# Altium schematic sheet Power_Path.SchDoc
size 297 x 209 mm; SheetNumber: 2; SheetTotal: 9
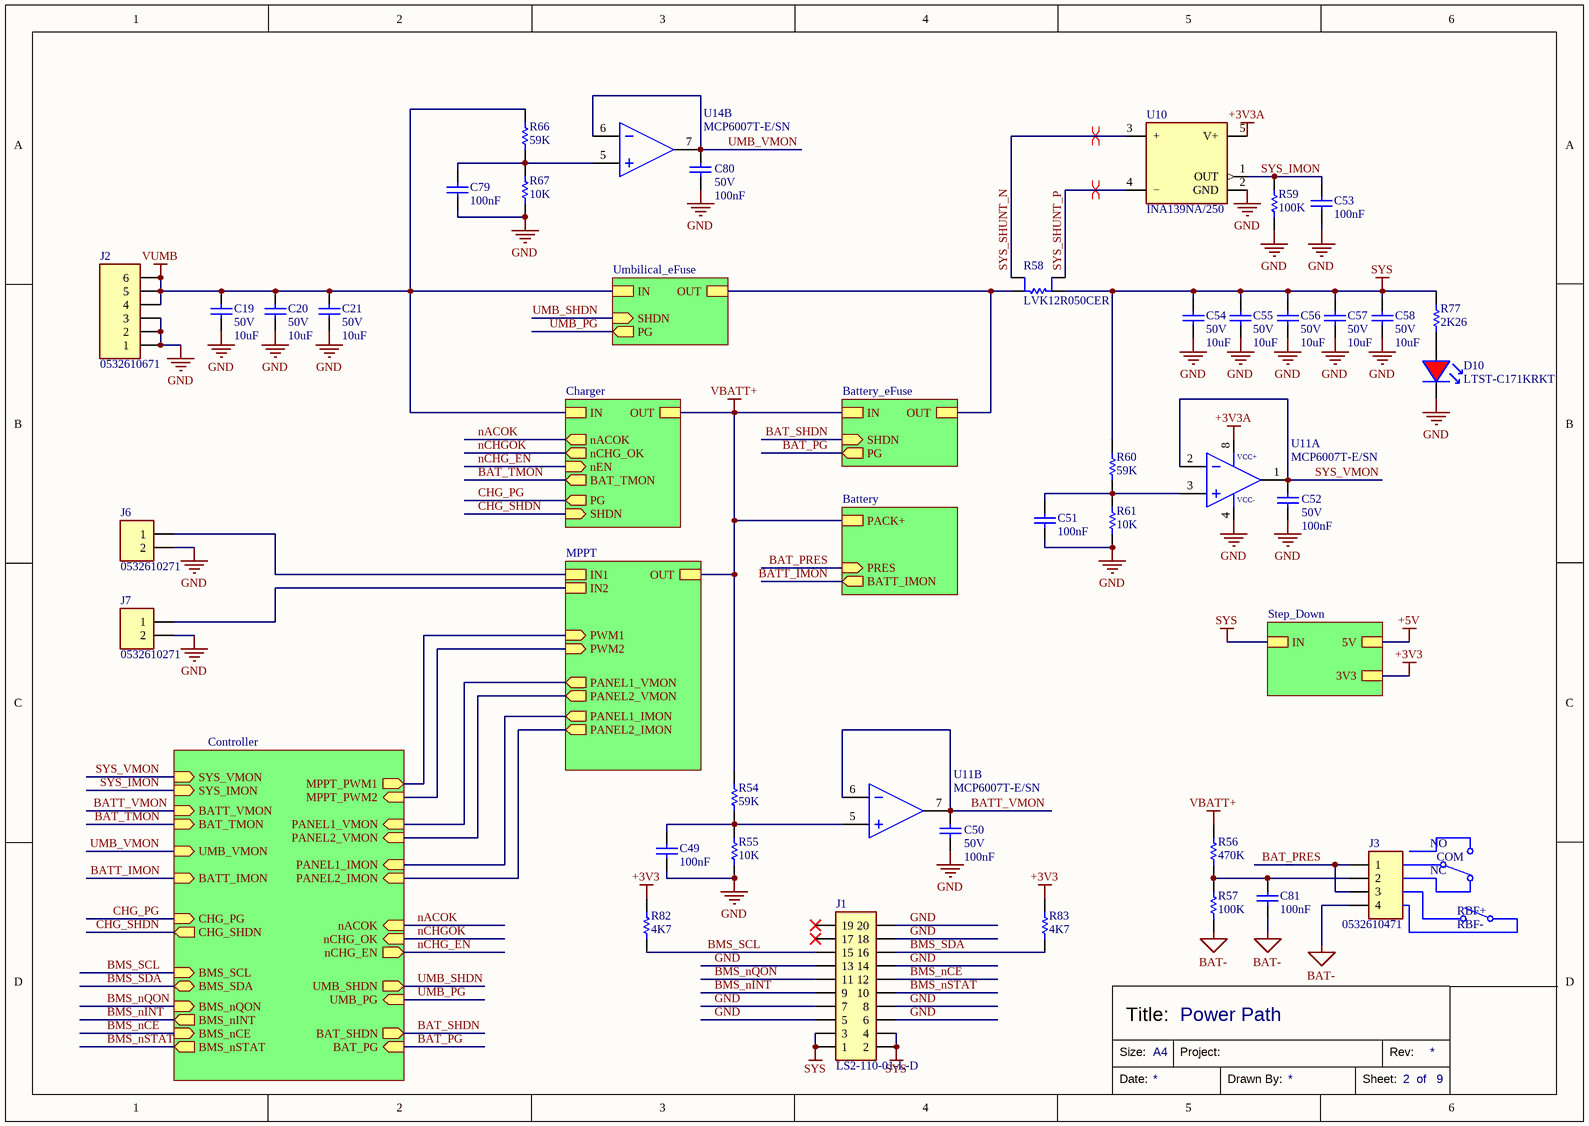
[diagram p0: Power_Path.SchDoc]

## Parts
C19  Voltage Rating: 50V  Capacitance: 10uF  [CAPC1210X090]  (hidden comment: CL32B106KBJNNNE)
C20  Voltage Rating: 50V  Capacitance: 10uF  [CAPC1210X090]  (hidden comment: CL32B106KBJNNNE)
C21  Voltage Rating: 50V  Capacitance: 10uF  [CAPC1210X090]  (hidden comment: CL32B106KBJNNNE)
C49  Capacitance: 100nF  [CAPC0603X040]  (hidden comment: C0603C104K5RACTU)
C50  Voltage Rating: 50V  Capacitance: 100nF  [CAPC0603X040]  (hidden comment: C0603C104K5RACTU)
C51  Capacitance: 100nF  [CAPC0603X040]  (hidden comment: C0603C104K5RACTU)
C52  Voltage Rating: 50V  Capacitance: 100nF  [CAPC0603X040]  (hidden comment: C0603C104K5RACTU)
C53  Capacitance: 100nF  [CAPC0603X040]  (hidden comment: C0603C104K5RACTU)
C54  Voltage Rating: 50V  Capacitance: 10uF  [CAPC1210X090]  (hidden comment: CL32B106KBJNNNE)
C55  Voltage Rating: 50V  Capacitance: 10uF  [CAPC1210X090]  (hidden comment: CL32B106KBJNNNE)
C56  Voltage Rating: 50V  Capacitance: 10uF  [CAPC1210X090]  (hidden comment: CL32B106KBJNNNE)
C57  Voltage Rating: 50V  Capacitance: 10uF  [CAPC1210X090]  (hidden comment: CL32B106KBJNNNE)
C58  Voltage Rating: 50V  Capacitance: 10uF  [CAPC1210X090]  (hidden comment: CL32B106KBJNNNE)
C79  Capacitance: 100nF  [CAPC0603X040]  (hidden comment: C0603C104K5RACTU)
C80  Voltage Rating: 50V  Capacitance: 100nF  [CAPC0603X040]  (hidden comment: C0603C104K5RACTU)
C81  Capacitance: 100nF  [CAPC0603X040]  (hidden comment: C0603C104K5RACTU)
D10  LTST-C171KRKT  [LEDR_0805]
J1  LS2-110-01-L-D  [LS2-110-01-L-D]
J2  0532610671  [0532610671]
J3  0532610471  [0532610471]
J6  0532610271  [0532610271]
J7  0532610271  [0532610271]
R54  Resistance: 59K  [RESC0603]  (hidden comment: RMCF0603FT59K0)
R55  Resistance: 10K  [RESC0603]  (hidden comment: RMCF0603FT10K0)
R56  Resistance: 470K  [RESC0603]  (hidden comment: RMCF0603FT470K)
R57  Resistance: 100K  [RESC0603]  (hidden comment: RMCF0603FT100K)
R58  LVK12R050CER  [LVK12R050CER-1]
R59  Resistance: 100K  [RESC0603]  (hidden comment: RMCF0603FT100K)
R60  Resistance: 59K  [RESC0603]  (hidden comment: RMCF0603FT59K0)
R61  Resistance: 10K  [RESC0603]  (hidden comment: RMCF0603FT10K0)
R66  Resistance: 59K  [RESC0603]  (hidden comment: RMCF0603FT59K0)
R67  Resistance: 10K  [RESC0603]  (hidden comment: RMCF0603FT10K0)
R77  Resistance: 2K26  [RESC0603]  (hidden comment: RMCF0603FT2K26)
R82  Resistance: 4K7  [RESC0603]  (hidden comment: RMCF0603FT4K7)
R83  Resistance: 4K7  [RESC0603]  (hidden comment: RMCF0603FT4K7)
U10  INA139NA/250  [SOT23-5 IC]
U11  MCP6007T-E/SN  [SOIC-8]  (parts A,B of 2)
U14  MCP6007T-E/SN  [SOIC-8]  (part B of 2)

## Sub-sheets
Battery = Battery_Protection: PACK+, PRES (in), BATT_IMON (out)
Battery_eFuse = Battery_eFuse: IN, OUT, SHDN (in), PG (out)
Charger = Charger: IN, OUT, nACOK (out), nCHG_OK (out), nEN (in), BAT_TMON (out), PG (out), SHDN (in)
Controller = Controller: MPPT_PWM1 (out), MPPT_PWM2 (in), PANEL1_VMON (in), PANEL2_VMON (in), PANEL1_IMON (in), PANEL2_IMON (in), nACOK (in), nCHG_OK (in), nCHG_EN (out), UMB_SHDN (out), UMB_PG (in), BAT_SHDN (out), BAT_PG (in), SYS_VMON (in), SYS_IMON (in), BAT_TMON (in), UMB_VMON (in), BATT_IMON (in), CHG_PG (in), CHG_SHDN (out), BATT_VMON (in), BMS_SCL (in), BMS_SDA (bidir), BMS_nINT (out), BMS_nCE (in), BMS_nSTAT (out), BMS_nQON (in)
MPPT = MPPT: IN1, OUT, PWM1 (in), IN2, PWM2 (in), PANEL1_VMON (out), PANEL2_VMON (out), PANEL1_IMON (out), PANEL2_IMON (out)
Step_Down = Step_Down: IN, 5V, 3V3
Umbilical_eFuse = Umbilical_eFuse: IN, OUT, SHDN (in), PG (out)

## Nets
+3V3: R82.2 R83.2 ; sheet Step_Down/3V3
+3V3A: U10.5(V+) U11.8(VCC+)
+5V: sheet Step_Down/5V
BAT-: C81.1 J3.4 R57.1
GND: C19.1 C20.1 C21.1 C49.1 C50.1 C51.1 C52.1 C53.1 C54.1 C55.1 C56.1 C57.1 C58.1 C79.1 C80.1 D10.K J1.5 J1.6 J1.7 J1.8 J1.13 J1.14 J1.18 J1.20 J2.1 J2.2 J2.3 J6.2 J7.2 R55.1 R59.1 R61.1 R67.1 U10.2(GND) U11.4(VCC-)
SYS: C54.2 C55.2 C56.2 C57.2 C58.2 J1.1 J1.2 J1.3 J1.4 R58.4 R60.2 R77.2 ; sheet Step_Down/IN
VBATT+: R54.2 R56.2 ; sheet Battery/PACK+, sheet Battery_eFuse/IN, sheet Charger/OUT, sheet MPPT/OUT
VUMB: C19.2 C20.2 C21.2 J2.4 J2.5 J2.6 R66.2 ; sheet Umbilical_eFuse/IN, sheet Charger/IN
BAT_PG: sheet Battery_eFuse/PG, sheet Controller/BAT_PG
BAT_PRES: J3.1 J3.3 ; sheet Battery/PRES
BAT_SHDN: sheet Battery_eFuse/SHDN, sheet Controller/BAT_SHDN
BAT_TMON: sheet Charger/BAT_TMON, sheet Controller/BAT_TMON
BATT_IMON: sheet Battery/BATT_IMON, sheet Controller/BATT_IMON
BATT_VMON: C50.2 U11.6(INB-) U11.7(OUTB) ; sheet Controller/BATT_VMON
BMS_nCE: J1.12 ; sheet Controller/BMS_nCE
BMS_nINT: J1.9 ; sheet Controller/BMS_nINT
BMS_nQON: J1.11 ; sheet Controller/BMS_nQON
BMS_nSTAT: J1.10 ; sheet Controller/BMS_nSTAT
BMS_SCL: J1.15 R82.1 ; sheet Controller/BMS_SCL
BMS_SDA: J1.16 R83.1 ; sheet Controller/BMS_SDA
CHG_PG: sheet Charger/PG, sheet Controller/CHG_PG
CHG_SHDN: sheet Charger/SHDN, sheet Controller/CHG_SHDN
nACOK: sheet Charger/nACOK, sheet Controller/nACOK
nCHG_EN: sheet Charger/nEN, sheet Controller/nCHG_EN
nCHGOK: sheet Charger/nCHG_OK, sheet Controller/nCHG_OK
SYS_IMON: C53.2 R59.2 U10.1(OUT) ; sheet Controller/SYS_IMON
SYS_SHUNT_N: R58.2 U10.3(+)
SYS_SHUNT_P: R58.3 U10.4(−)
SYS_VMON: C52.2 U11.1(OUTA) U11.2(INA-) ; sheet Controller/SYS_VMON
UMB_PG: sheet Umbilical_eFuse/PG, sheet Controller/UMB_PG
UMB_SHDN: sheet Umbilical_eFuse/SHDN, sheet Controller/UMB_SHDN
UMB_VMON: C80.2 U14.6(INB-) U14.7(OUTB) ; sheet Controller/UMB_VMON
NetC49_2: C49.2 R54.1 R55.2 U11.5(INB+)
NetC51_2: C51.2 R60.1 R61.2 U11.3(INA+)
NetC79_2: C79.2 R66.1 R67.2 U14.5(INB+)
NetC81_2: C81.2 J3.2 R56.1 R57.2
NetD10_A: D10.A R77.1
NetJ6_1: J6.1 ; sheet MPPT/IN1
NetJ7_1: J7.1 ; sheet MPPT/IN2
NetR58_1: R58.1 ; sheet Battery_eFuse/OUT, sheet Umbilical_eFuse/OUT
(unnamed): sheet MPPT/PWM1, sheet Controller/MPPT_PWM1
(unnamed): sheet MPPT/PWM2, sheet Controller/MPPT_PWM2
(unnamed): sheet MPPT/PANEL1_VMON, sheet Controller/PANEL1_VMON
(unnamed): sheet MPPT/PANEL2_VMON, sheet Controller/PANEL2_VMON
(unnamed): sheet MPPT/PANEL1_IMON, sheet Controller/PANEL1_IMON
(unnamed): sheet MPPT/PANEL2_IMON, sheet Controller/PANEL2_IMON

Not connected (* = marked no-connect by the designer): J1 17* 19*

## Layout directives
differential pair: SYS_SHUNT_N, SYS_SHUNT_P

## Notes on the sheet
- (near J3) NC
- (near J3) NO
- (near J3) COM
- RBF+
- RBF-
- Power Path
- Size:
- Title:
- A4
- Project:
- Rev:
- Date:
- Drawn By:
- Sheet:
- of

## Library data of the parts
C19-C21 C54-C58 = CL32B106KBJNNNE: 10 µF ±10% 50V Ceramic Capacitor X7R 1210 (3225 Metric); Manufacturer Part Number: CL32B106KBJNNNE; Distributor Part Number: 1276-3387-1-ND; Tolerance: 10%; Case Code: 1210; Distributor: Digikey
C49-C53 C79-C81 = C0603C104K5RACTU: 0.1 µF ±10% 50V Ceramic Capacitor X7R 0603 (1608 Metric); Part Number: C0603C104K5RACTU; Distributor Part Number: 399-C0603C104K5RACTUCT-ND; Tolerance: 10%; Case Code: 0603; Distributor: Digikey
  C49 C51 C53 C79 C81: Voltage Rating: 50V
D10 = LTST-C171KRKT: Red 631nm LED Indication - Discrete 2V 0805 (2012 Metric); Part Number: LTST-C171KRKT; Distributor Part Number: 160-1427-1-ND; Colour: Red; Operating Temperature: -30℃~+85℃; Distributor: Digikey
J1 = LS2-110-01-L-D: Connector Self Mating 20 Position , Non-Gendered, Hermaphroditic Through Hole Gold; Number of Positions: 20; Contact Rating: 3.2A; Voltage Rating: 475VAC; Part Number: LS2-110-01-L-D; Distributor Part Number: SAM9665-ND; Distributor: Digikey; Number of Rows: 2; Operating Temperature: -55C ~ 125C
J2 = 0532610671: Connector Header Surface Mount, Right Angle 6 position 0.049" (1.25mm) Picoblade; Number of Positions: 6; Contact Current (Max): 1A; Material Flammability Rating: UL94 V-0; Part Number: 0532610671; Distributor Part Number: WM7624CT-ND; Distributor: Digikey
J3 = 0532610471: Connector Header Surface Mount, Right Angle 4 position 0.049" (1.25mm) Molex Picoblade; Number of Positions: 4; Max Current Per Contact: 1A; Part Number: 0532610471; Distributor: Digikey; Distributor Part Number: WM7622CT-ND; Number of Rows: 2
J6 J7 = 0532610271: Connector Header, Picoblade Surface Mount, Right Angle 2 position 0.049" (1.25mm); Number of Positions: 2; Max Current Per Contact: 1A; Part Number: 0532610271; Distributor: Digikey; Distributor Part Number: WM7620CT-ND; Number of Rows: 1
R54 R60 R66 = RMCF0603FT59K0: 59 kOhms ±1% 0.1W, 1/10W Chip Resistor 0603 (1608 Metric) Automotive AEC-Q200 Thick Film; Part Number: RMCF0603FT59K0; Tolerance: 1%; Distributor Part Number: RMCF0603FT59K0CT-ND; Distributor: Digikey; Case Code: 0603
R55 R61 R67 = RMCF0603FT10K0: 10 kOhms ±1% 0.1W, 1/10W Chip Resistor 0603 (1608 Metric) Automotive AEC-Q200 Thick Film; Part Number: RMCF0603FT10K0; Tolerance: 1%; Distributor: Digikey; Distributor Part Number: RMCF0603FT10K0CT-ND; Case Code: 0603
R56 = RMCF0603FT470K: 470 kOhms ±1% 0.1W, 1/10W Chip Resistor 0603 (1608 Metric) Automotive AEC-Q200 Thick Film; Part Number: RMCF0603FT470K; Tolerance: 1%; Distributor: Digikey; Distributor Part Number: RMCF0603FT470KCT-ND; Case Code: 0603
R57 R59 = RMCF0603FT100K: 100 kOhms ±1% 0.1W, 1/10W Chip Resistor 0603 (1608 Metric) Automotive AEC-Q200 Thick Film; Part Number: RMCF0603FT100K; Tolerance: 1%; Distributor: Digikey; Distributor Part Number: RMCF0603FT100KCT-ND; Case Code: 0603
R58 = LVK12R050CER: Resistor, Current Sense 50 mOhms ±0.25% 0.5W, Moisture Resistant Thick Film; Manufacturer: Ohmite; Temperature Coefficient: ±50ppm/°C; Resistance: 50mOhm; Part Number: LVK12R050CER; Distributor: Mouser; Distributor Part Number: 588-LVK12R050CER; Power: 0.5W; Tolerance: 0.25%
R77 = RMCF0603FT2K26: 2.26 kOhms ±1% 0.1W, 1/10W Chip Resistor 0603 (1608 Metric) Automotive AEC-Q200 Thick Film; Part Number: RMCF0603FT2K26; Tolerance: 1%; Distributor Part Number: RMCF0603FT2K26CT-ND; Distributor: Digikey; Case Code: 0603
R82 R83 = RMCF0603FT4K7: 4.7 kOhms ±1% 0.1W, 1/10W Chip Resistor 0603 (1608 Metric) Automotive AEC-Q200 Thick Film; Part Number: RMCF0603FT4K7; Tolerance: 1%; Distributor: Digikey; Distributor Part Number: RMCF0603FT4K70CT-ND; Case Code: 0603
U10 = INA139NA/250: 40V Current Sense Amplifier 1 Circuit 8-MSOP; Accuracy: 0.5%; Distributor: Digikey; Distributor Part Number: INA139NA/250CT-ND; Operating Temperature: -40°C ~ 125°C; Part Number: INA139NA/250
U11 U14 = MCP6007T-E/SN: Operational Amplifier general purpose, 2-Circuit 1.8V ~ 5.5V 1MHz; Slew Rate: 1.9V/us; Part Number: MCP6007T-E/SN; Distributor: Digikey; Distributor Part Number: 150-MCP6007T-E/SNCT-ND; Input Voltage: 1.8V ~ 5.5V; Operating Temperature: -40°C ~ 125°C; Gain Bandwidth Product: 1MHz